# Altium schematic sheet 5_Ethernet.SchDoc: Apalis Evaluation Board 1.1
size A3; Organization: Toradex AG; Address1: Altsagenstrasse 5; Address2: Horw; Address3: 6048; Address4: Switzerland; DocumentNumber: 9; Revision: V1.1; SheetNumber: 9; SheetTotal: 32; PageSetup: Record=PageOptions|CenterHorizontal=True|CenterVertical=True|PrintScale=0.73|XCorrection=1.00|YCorrection=1.00|PrintKind=0|BorderSize=5000000|LeftOffset=0|BottomOffset=0|Orientation=2|PaperLength=1000|PaperWidth=1000|Scale=100|PaperSource=7|PrintQuality=-4|MediaType=1|DitherType=10|PaperKind=A4|PrintScaleMode=1
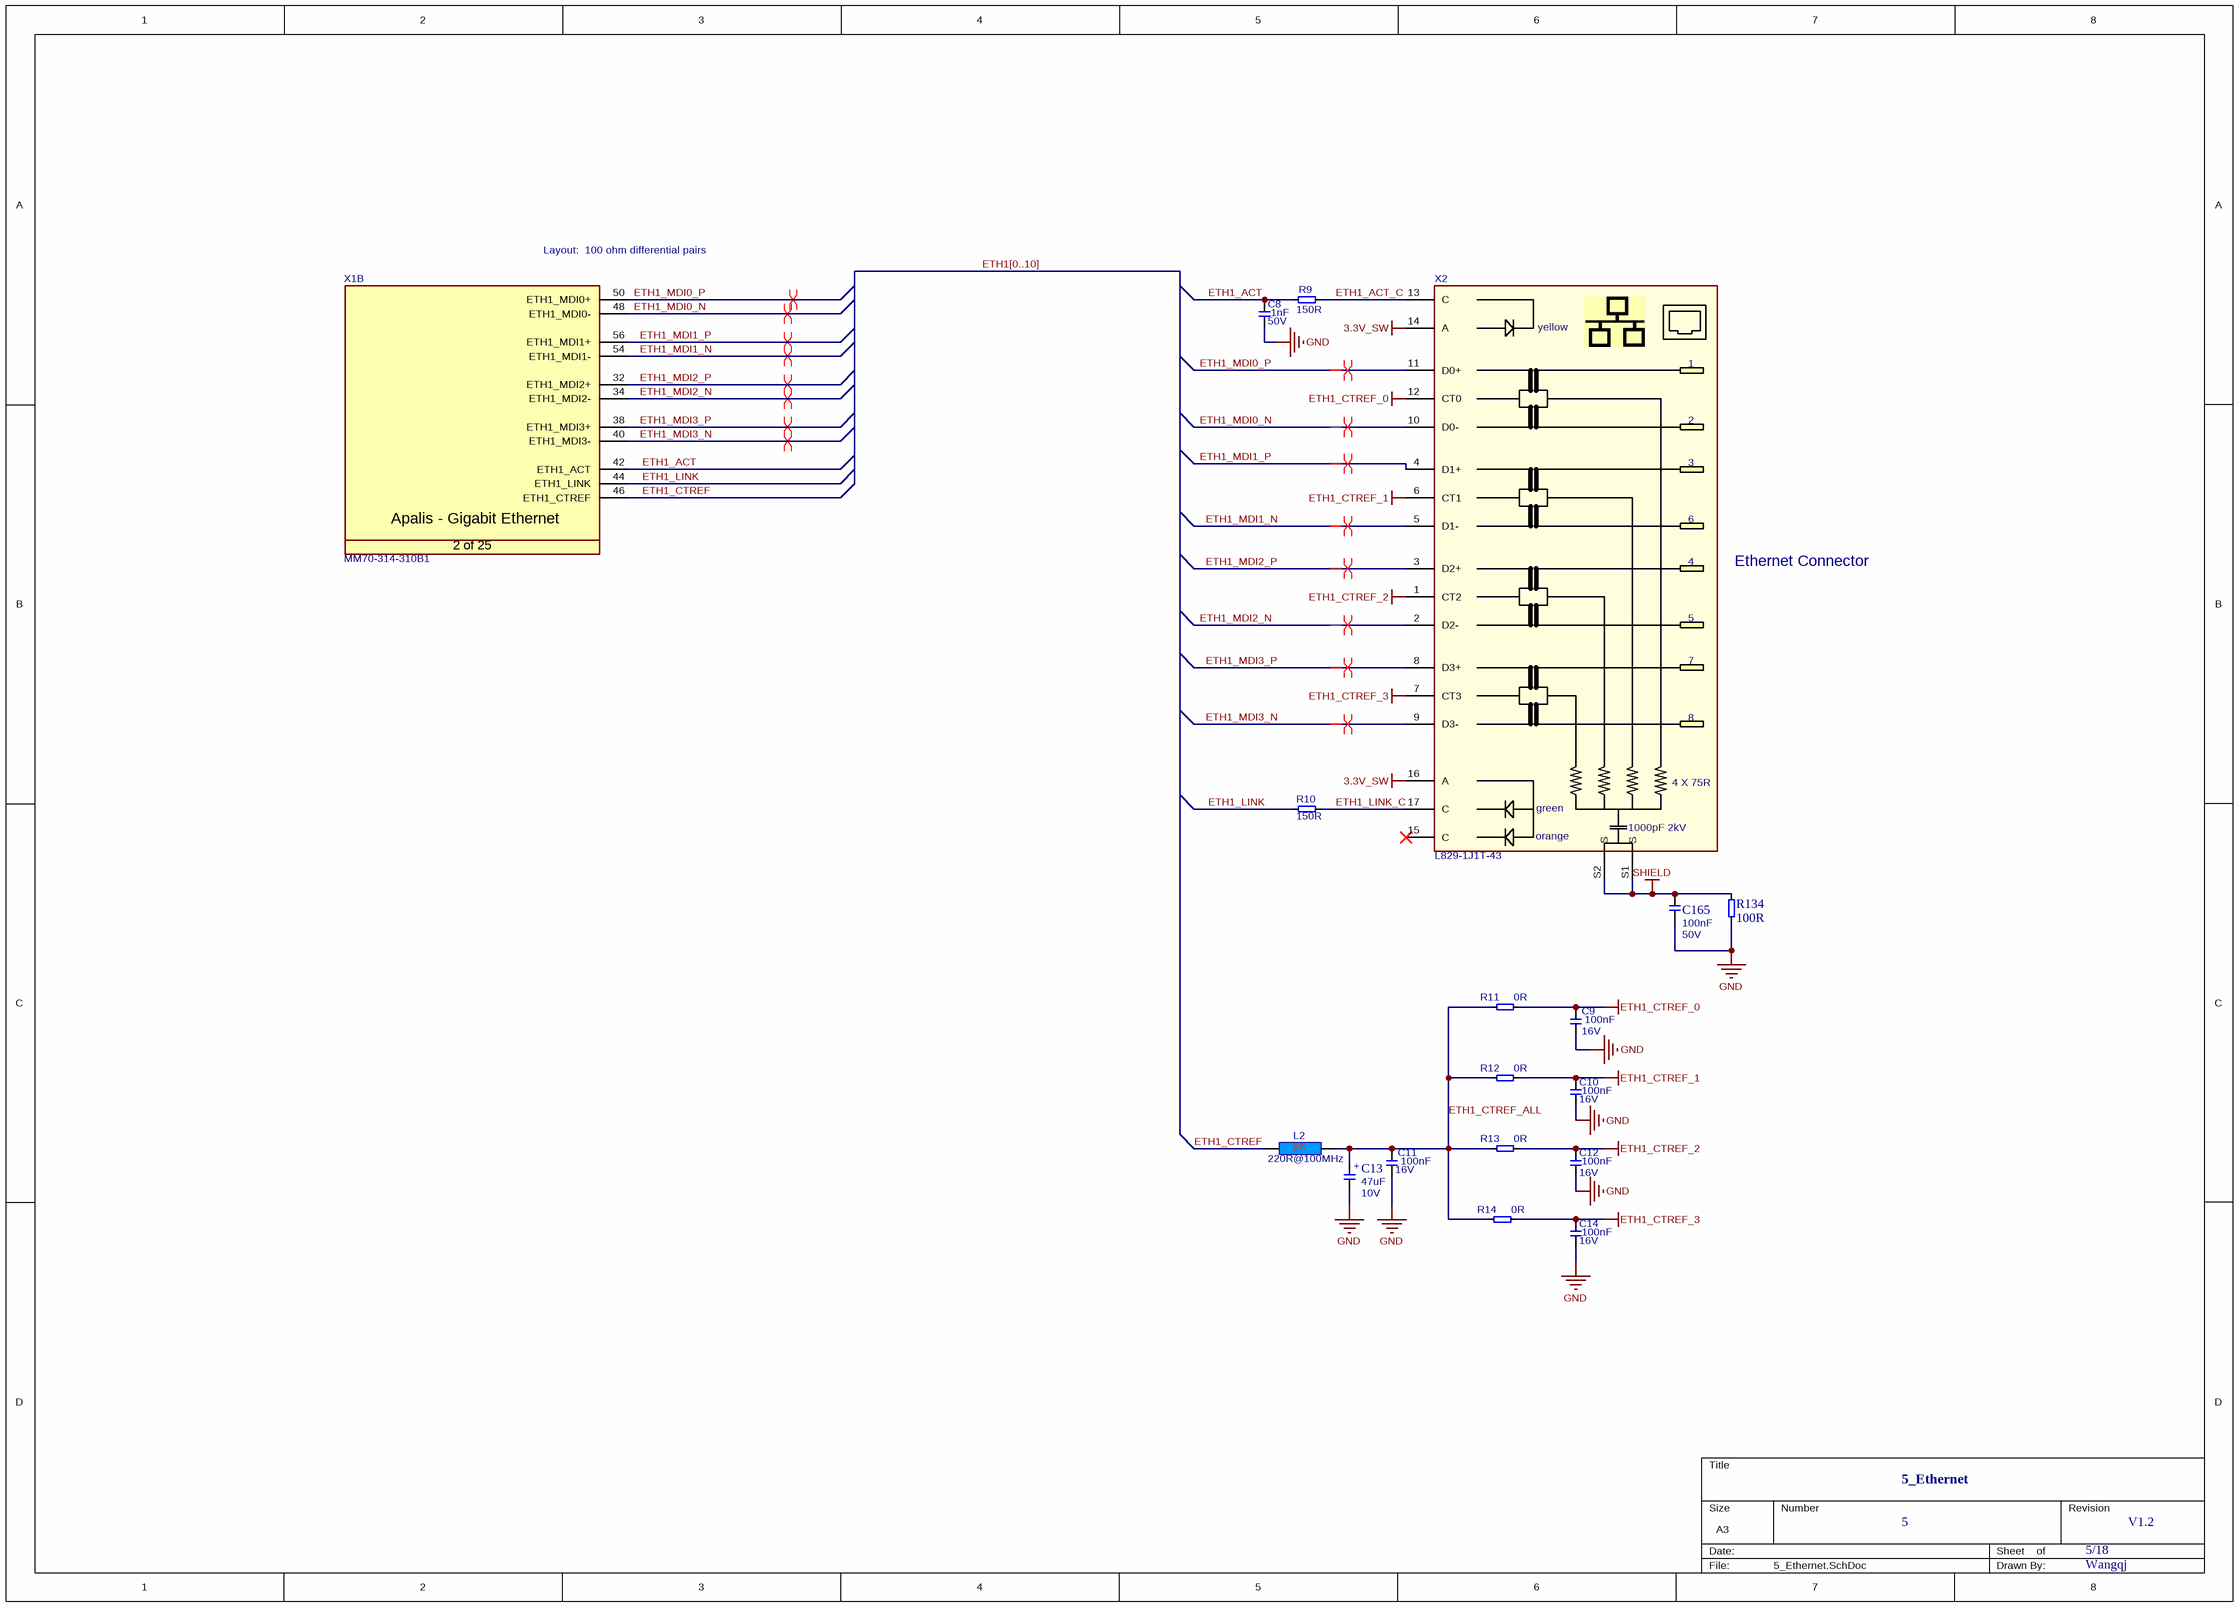
[diagram p0: 5_Ethernet.SchDoc]

## Parts
C8  Rating: 50V  [CAPC1005X60N]  (hidden comment: 1nF)
C9  Rating: 16V  [T_CAPC0603X33N]  (hidden comment: 100nF)
C10  Rating: 16V  [T_CAPC0603X33N]  (hidden comment: 100nF)
C11  Rating: 16V  [T_CAPC0603X33N]  (hidden comment: 100nF)
C12  Rating: 16V  [T_CAPC0603X33N]  (hidden comment: 100nF)
C13  Rating: 10V  [T_CAPMP3216X180N]  (hidden comment: 47uF)
C14  Rating: 16V  [T_CAPC0603X33N]  (hidden comment: 100nF)
C165  Rating: 50V  [T_CAPC0603X33N]  (hidden comment: 100nF)
L2  220R@100MHz  [INDC1608X95N]
R9  150R  [t_RESC0603X30N]
R10  150R  [t_RESC0603X30N]
R11  0R  [T_RESC0603X30N]
R12  0R  [T_RESC0603X30N]
R13  0R  [T_RESC0603X30N]
R14  0R  [T_RESC0603X30N]
R134  100R  [T_RESC0603X30N]
X1  Manufacturer Part No.: MM70-314-310B1  [T_JAE_MM70-314-310B1]  (hidden comment: CON-JAE-MM70-314-310B1-314-0.5mm)  (part B of 25)
X2  L829-1J1T-43  [T_BEL_L829-1J1T-43]

## Nets
3.3V_SW: X2.14(A) X2.16(A)
ETH1_CTREF_0: C9.2 R11.2 X2.12(CT0)
ETH1_CTREF_1: C10.2 R12.2 X2.6(CT1)
ETH1_CTREF_2: C12.2 R13.2 X2.1(CT2)
ETH1_CTREF_3: C14.2 R14.2 X2.7(CT3)
GND: C8.1 C9.1 C10.1 C11.1 C12.1 C13.2 C14.1 C165.1 R134.1
SHIELD: C165.2 R134.2 X2.S1(S) X2.S2(S)
ETH1_ACT: C8.2 R9.1 X1.42(ETH1_ACT)
ETH1_ACT_C: R9.2 X2.13(C)
ETH1_CTREF: L2.1 X1.46(ETH1_CTREF)
ETH1_CTREF_ALL: C11.2 C13.1 L2.2 R11.1 R12.1 R13.1 R14.1
ETH1_LINK: R10.1 X1.44(ETH1_LINK)
ETH1_LINK_C: R10.2 X2.17(C)
ETH1_MDI0_N: X1.48(ETH1_MDI0-) X2.10(D0-)
ETH1_MDI0_P: X1.50(ETH1_MDI0+) X2.11(D0+)
ETH1_MDI1_N: X1.54(ETH1_MDI1-) X2.5(D1-)
ETH1_MDI1_P: X1.56(ETH1_MDI1+) X2.4(D1+)
ETH1_MDI2_N: X1.34(ETH1_MDI2-) X2.2(D2-)
ETH1_MDI2_P: X1.32(ETH1_MDI2+) X2.3(D2+)
ETH1_MDI3_N: X1.40(ETH1_MDI3-) X2.9(D3-)
ETH1_MDI3_P: X1.38(ETH1_MDI3+) X2.8(D3+)

Not connected (* = marked no-connect by the designer): X2 15(C)*

## Buses and harness runs
bus ETH1[0..10]

## Layout directives
differential pair: ETH1_MDI0_N, ETH1_MDI0_P, ETH1_MDI1_N, ETH1_MDI1_P, ETH1_MDI2_N, ETH1_MDI2_P, ETH1_MDI3_N, ETH1_MDI3_P

## Notes on the sheet
- (near X1) Layout:  100 ohm differential pairs
- Ethernet Connector
- 5_Ethernet
- 5
- 5/18
- V1.2
- Wangqj
- Title
- Size:
- Date:
- A3
- Number:
- Time:
- Revision:
- Sheet
- of
- File:
- (in symbol C-47uF-10V-10%-3216-TA) +
- (in symbol CON-BEL-L829-1J1T-43) yellow; 4 X 75R; green; 1000pF 2kV; orange
- (in symbol CON-JAE-MM70-314-310B1-314-0.5mm, part B) Apalis - Gigabit Ethernet; 2 of 25

## Library data of the parts
C8 = C-X7R-1nF-50V-10%-0402: Capacitor Ceramic X7R 1nF 50V 10% 0402; Tolerance: 10%; Type: X7R; Value: 1nF
C9-C12 C14 = C-X7R-100nF-16V-10%-0603: Capacitor Ceramic X7R 100nF 16V 10% 0603; Tolerance: 10%; Type: X7R; Value: 100nF
C13 = C-47uF-10V-10%-3216-TA: Capacitor TA 47uF 10V 10% 3216; Tolerance: 10%; Type: TA; Value: 47uF
C165 = C-100nF-50V-20%-0603-X7R: Capacitor Ceramic X7R 100nF 50V 20% 0603; Tolerance: 20%; Type: X7R; Value: 100nF
L2 = L-220R@100MHz-2A-25%-0603: 220R@100MHz 2A EMI FILTER; Tolerance: 25%; Rating: 2A; Value: 220R@100MHz
R9 R10 = R-150R-63mW-1%-0603: Resistor 150 ohm 63mW 1% 0603; Tolerance: 1%; Value: 150R; Rating: 63mW
R11-R14 = R-0R-63mW-1%-0603: Resistor 0 ohm 63mW 1% 0603; Rating: 63mW; Tolerance: 1%; Value: 0R
R134 = R-120R-63mW-5%-0603: Resistor 120 ohm 63mW 5% 0603; Rating: 63mW; Tolerance: 5%; Value: 100R
X1 = CON-JAE-MM70-314-310B1-314-0.5mm: MXM3 Connector; Manufacturer Name: JAE; No. of ways: 314
X2 = CON-BEL-L829-1J1T-43: Low profile 10/100/1G Mag Jack; Manufacturer Name: BEL; Manufacturer Part No.: L829-1J1T-43